# EAGLE design clock2 (EAGLE 5.11)

## Sheet 1 of 3
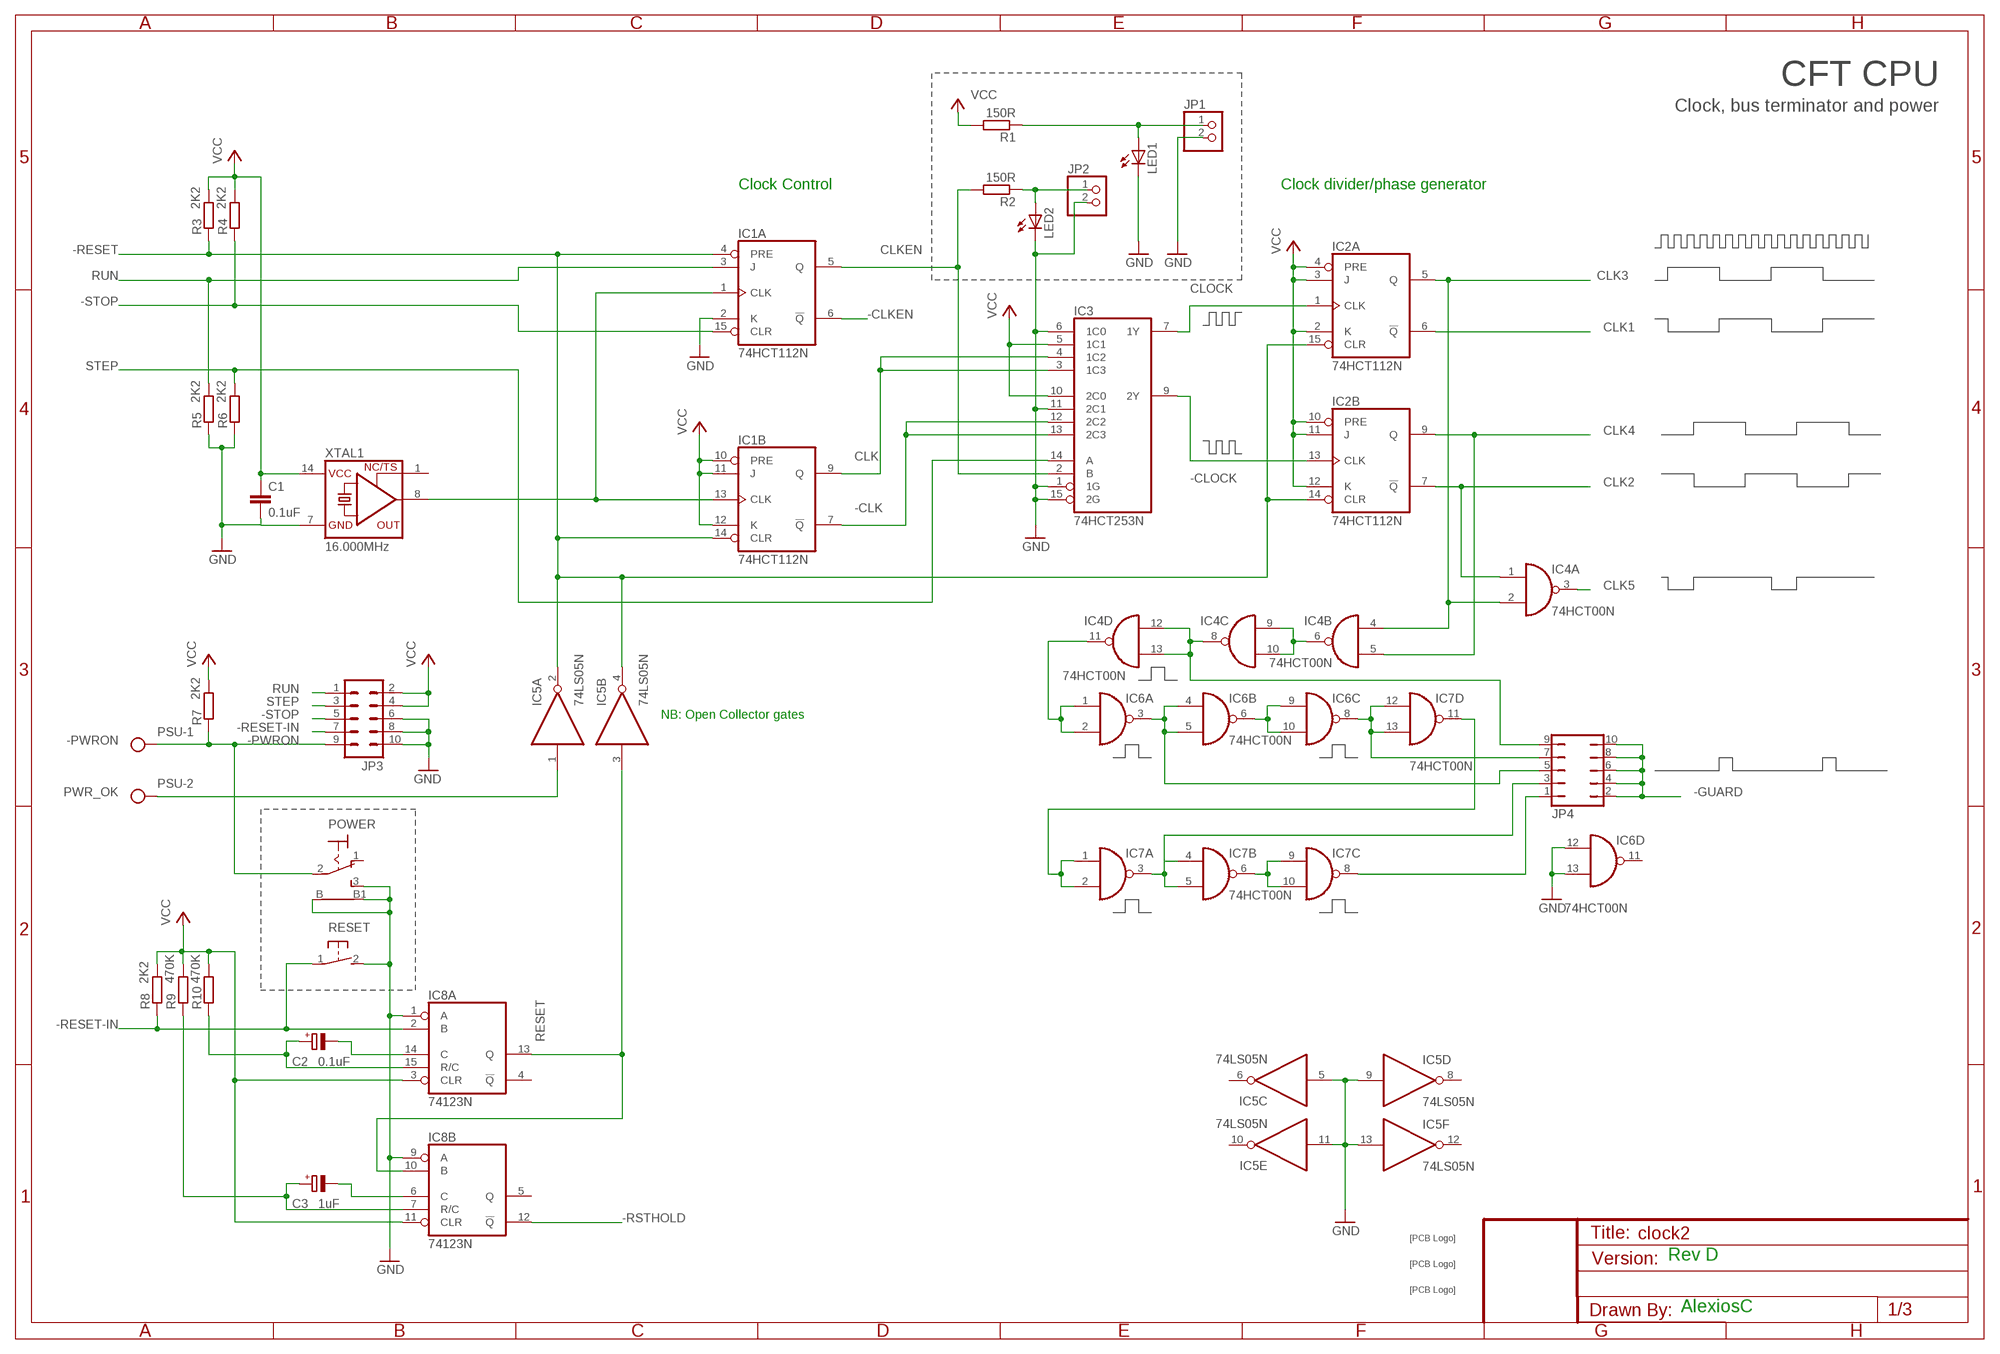
[diagram p0: schematic, sheet 1]

### Parts
C1  0.1uF  C-EU025-025X050  [C025-025X050]
C2  0.1uF  CPOL-EUE2.5-6  [E2,5-6]
C3  1uF  CPOL-EUE2.5-6  [E2,5-6]
IC1  74HCT112N  [DIL16]
IC2  74HCT112N  [DIL16]
IC3  74HCT253N  [DIL16]
IC4  74HCT00N  [DIL14]
IC5  74LS05N  [DIL14]
IC6  74HCT00N  [DIL14]
IC7  74HCT00N  [DIL14]
IC8  74123N  [DIL16]
JP1  PINHD-1X2  [1X02]
JP2  PINHD-1X2  [1X02]
JP3  ML10  [ML10]
JP4  JP5Q  [JP5Q]
LED1  DIALIGHT_555-1XXXF  [LED_PCB2]
LED2  DIALIGHT_555-1XXXF  [LED_PCB2]
POWER  9070-1W  [9070-1W]
PSU  W237-102  [W237-102]
R1  150R  R-EU_0204/7  [0204/7]
R2  150R  R-EU_0204/7  [0204/7]
R3  2K2  R-EU_0204/7  [0204/7]
R4  2K2  R-EU_0204/7  [0204/7]
R5  2K2  R-EU_0204/7  [0204/7]
R6  2K2  R-EU_0204/7  [0204/7]
R7  2K2  R-EU_0204/7  [0204/7]
R8  2K2  R-EU_0204/7  [0204/7]
R9  470K  R-EU_0204/7  [0204/7]
R10  470K  R-EU_0204/7  [0204/7]
RESET  31-XX  [B3F-31XX]
U$1  SIGNATUREPLANE  [SIGNATURE_PLANE]
U$2  SIGNATUREPLANE  [SIGNATURE_PLANE]
U$3  SIGNATURESILK  [SIGNATURE]
XTAL1  16.000MHz  XO-14  [DIL14S]

### Nets
-CLK: IC1.7(B:!Q) IC3.12(2C2) IC3.13(2C3)
-CLKEN: IC1.6(A:!Q)
-CLOCK: IC2.13(B:CLK) IC3.9(2Y)
-GUARD: JP4.2 JP4.4 JP4.6 JP4.8 JP4.10 ; also sheet 2,3
-PWRON: JP3.9 POWER.2(P) PSU.1 R7.1
-RESET: IC1.4(A:PRE) IC1.14(B:CLR) IC2.14(B:CLR) IC2.15(A:CLR) IC5.2(A:O) IC5.4(B:O) R3.1 ; also sheet 2,3
-RESET-IN: IC8.2(A:B) JP3.7 R8.1 RESET.1(P)
-RSTHOLD: IC8.12(B:!Q) ; also sheet 2,3
-STOP: IC1.15(A:CLR) JP3.5 R4.1
CLK: IC1.9(B:Q) IC3.3(1C3) IC3.4(1C2)
CLK1: IC2.6(A:!Q) ; also sheet 3
CLK2: IC2.7(B:!Q) IC4.1(A:I0) ; also sheet 3
CLK3: IC2.5(A:Q) IC4.2(A:I1) IC4.4(B:I0) ; also sheet 3
CLK4: IC2.9(B:Q) IC4.5(B:I1) ; also sheet 3
CLK5: IC4.3(A:O) ; also sheet 3
CLKEN: IC1.5(A:Q) IC3.2(B) R2.2
CLOCK: IC2.1(A:CLK) IC3.7(1Y)
GND: C1.2 IC1.2(A:K) IC3.1(1G) IC3.6(1C0) IC3.11(2C1) IC3.15(2G) IC5.5(C:I) IC5.9(D:I) IC5.11(E:I) IC5.13(F:I) IC6.12(D:I0) IC6.13(D:I1) IC8.1(A:A) IC8.9(B:A) JP1.2 JP2.2 JP3.6 JP3.8 JP3.10 LED1.K(C) LED2.K(C) POWER.3(S) POWER.B POWER.B1 R5.1 R6.1 RESET.2(S) XTAL1.7(GND) ; also sheet 2,3
N$2: IC7.8(C:O) JP4.1
N$5: IC1.1(A:CLK) IC1.13(B:CLK) XTAL1.8(OUT)
N$6: C2.+ IC8.15(A:R/C) R10.2
N$8: C2.- IC8.14(A:C)
N$9: C3.+ IC8.7(B:R/C) R9.2
N$10: C3.- IC8.6(B:C)
N$11: IC6.3(A:O) IC6.4(B:I0) IC6.5(B:I1) JP4.5
N$12: IC6.6(B:O) IC6.9(C:I0) IC6.10(C:I1)
N$13: IC6.8(C:O) IC7.12(D:I0) IC7.13(D:I1) JP4.7
N$14: IC7.1(A:I0) IC7.2(A:I1) IC7.11(D:O)
N$15: IC7.3(A:O) IC7.4(B:I0) IC7.5(B:I1) JP4.3
N$16: IC7.6(B:O) IC7.9(C:I0) IC7.10(C:I1)
N$18: IC4.6(B:O) IC4.9(C:I0) IC4.10(C:I1)
N$19: IC4.8(C:O) IC4.12(D:I0) IC4.13(D:I1) JP4.9
N$20: IC4.11(D:O) IC6.1(A:I0) IC6.2(A:I1)
N$49: JP2.1 LED2.A R2.1
POWERLED: JP1.1 LED1.A R1.1
PWR_OK: IC5.1(A:I) PSU.2
RESET: IC5.3(B:I) IC8.10(B:B) IC8.13(A:Q)
RUN: IC1.3(A:J) JP3.1 R5.2
STEP: IC3.14(A) JP3.3 R6.2
VCC: C1.1 IC1.10(B:PRE) IC1.11(B:J) IC1.12(B:K) IC2.2(A:K) IC2.3(A:J) IC2.4(A:PRE) IC2.10(B:PRE) IC2.11(B:J) IC2.12(B:K) IC3.5(1C1) IC3.10(2C0) IC8.3(A:CLR) IC8.11(B:CLR) JP3.2 JP3.4 R1.2 R3.2 R4.2 R7.2 R8.2 R9.1 R10.1 XTAL1.14(VCC) ; also sheet 2,3
Unconnected: IC5.6(C:O) IC5.8(D:O) IC5.10(E:O) IC5.12(F:O) IC6.11(D:O) IC8.4(A:!Q) IC8.5(B:Q) POWER.1(O) XTAL1.1(TS)

### Notes on the sheet
- CFT CPU
- Clock, bus terminator and power
- Clock Control | Clock divider/phase generator
- NB: Open Collector gates
- Rev D
- AlexiosC

## Sheet 2 of 3
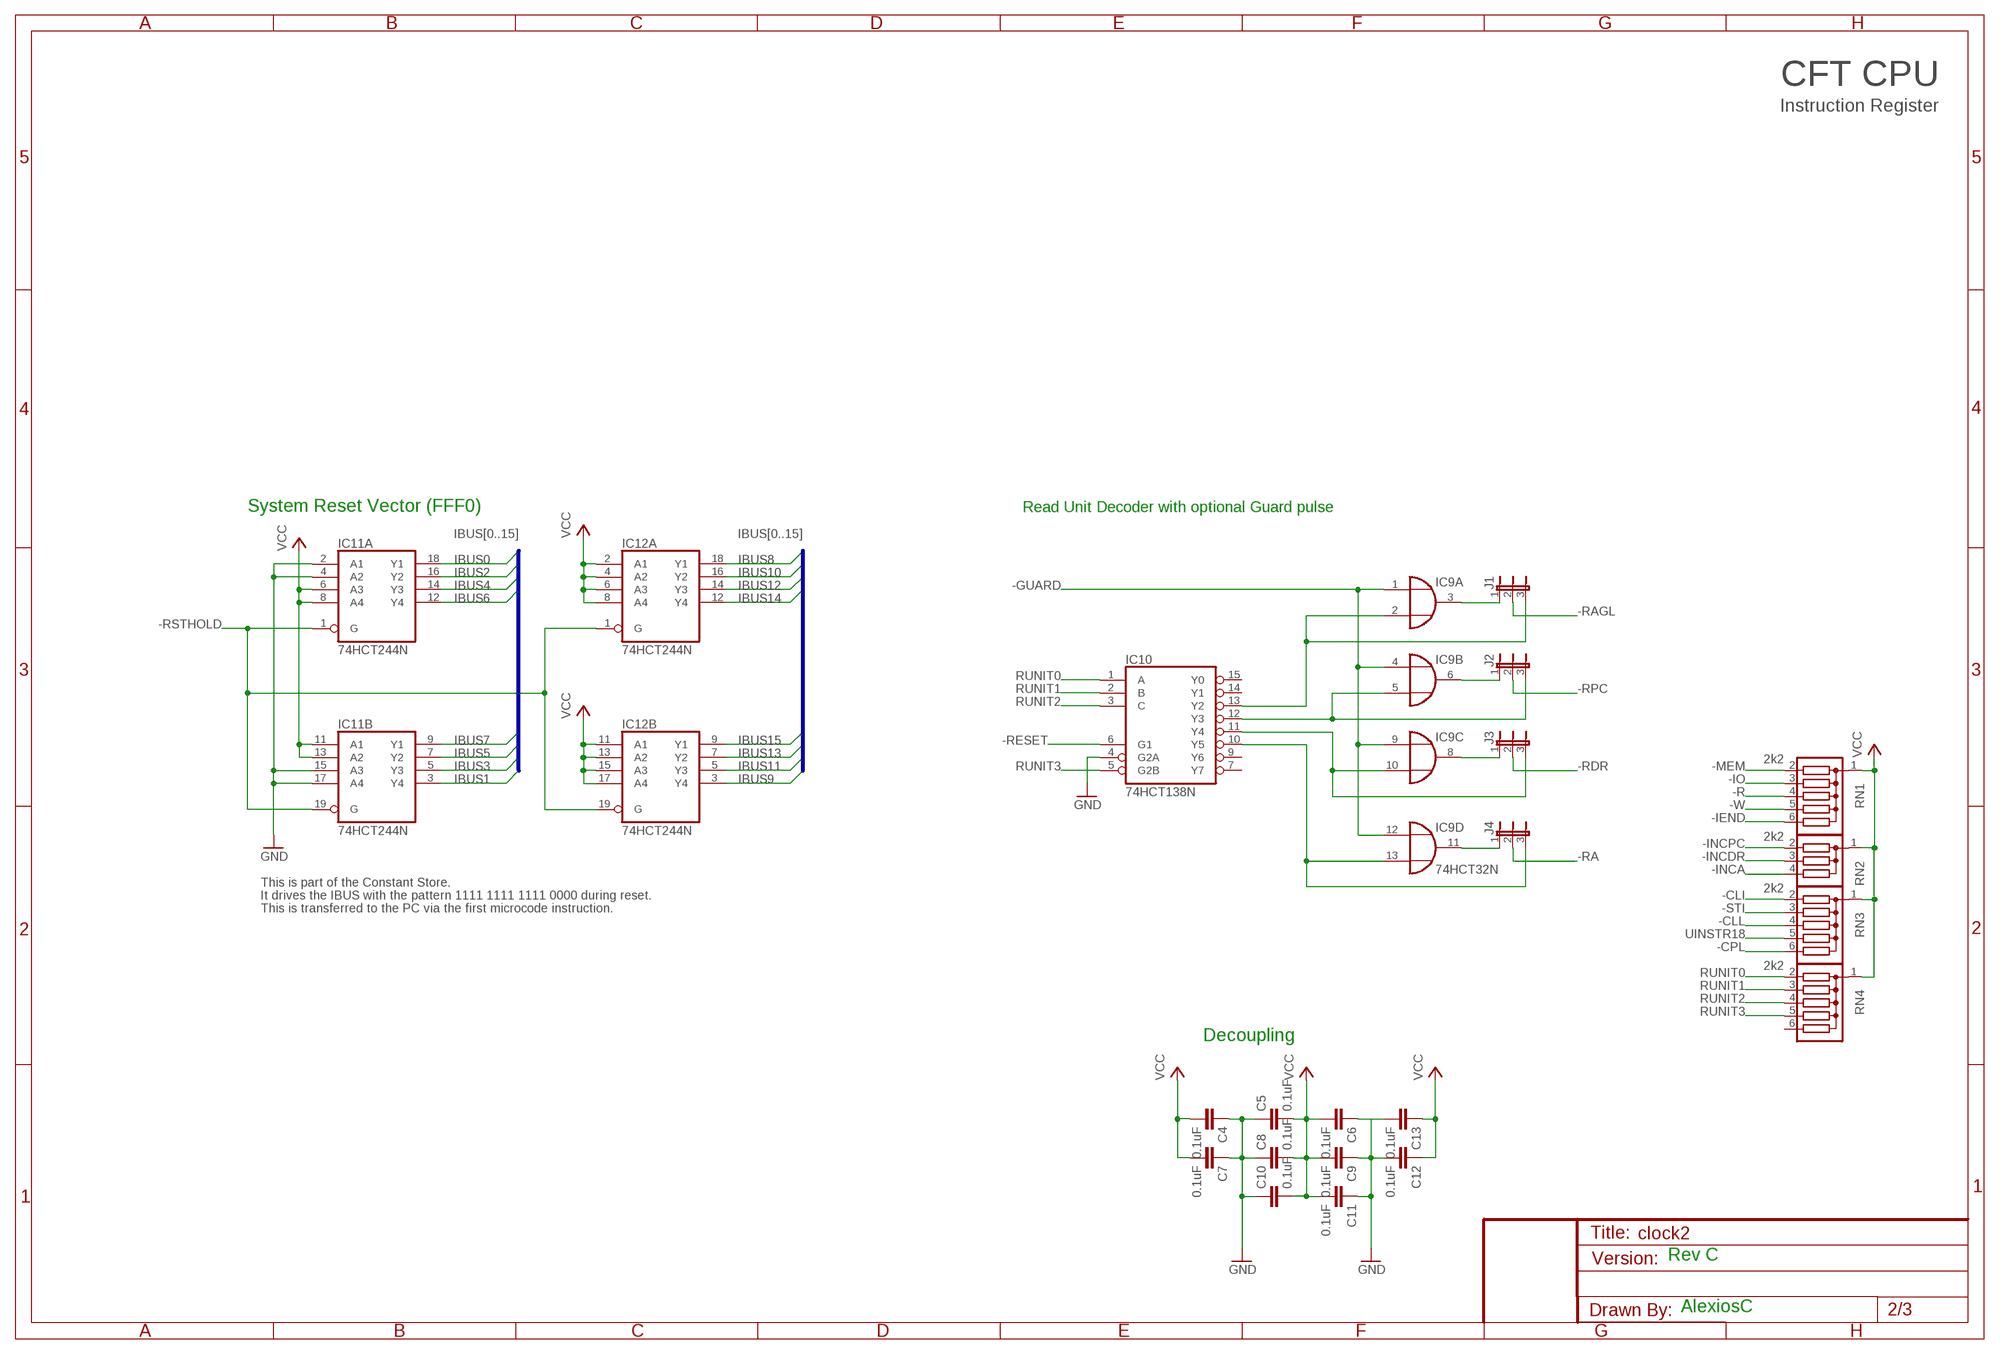
[diagram p1: schematic, sheet 2]

### Parts
C4  0.1uF  C-EU025-025X050  [C025-025X050]
C5  0.1uF  C-EU025-025X050  [C025-025X050]
C6  0.1uF  C-EU025-025X050  [C025-025X050]
C7  0.1uF  C-EU025-025X050  [C025-025X050]
C8  0.1uF  C-EU025-025X050  [C025-025X050]
C9  0.1uF  C-EU025-025X050  [C025-025X050]
C10  0.1uF  C-EU025-025X050  [C025-025X050]
C11  0.1uF  C-EU025-025X050  [C025-025X050]
C12  0.1uF  C-EU025-025X050  [C025-025X050]
C13  0.1uF  C-EU025-025X050  [C025-025X050]
IC9  74HCT32N  [DIL14]
IC10  74HCT138N  [DIL16]
IC11  74HCT244N  [DIL20]
IC12  74HCT244N  [DIL20]
J1  JP2E  [JP2]
J2  JP2E  [JP2]
J3  JP2E  [JP2]
J4  JP2E  [JP2]
RN1  2k2  G05R  [SIL6]
RN2  2k2  G03R  [SIL4]
RN3  2k2  G05R  [SIL6]
RN4  2k2  G05R  [SIL6]

### Nets
-CLI: RN3.2 ; also sheet 3
-CLL: RN3.4 ; also sheet 3
-CPL: RN3.6 ; also sheet 3
-GUARD: IC9.1(A:I0) IC9.4(B:I0) IC9.9(C:I0) IC9.12(D:I0) ; also sheet 1,3
-IEND: RN1.6
-INCA: RN2.4 ; also sheet 3
-INCDR: RN2.3 ; also sheet 3
-INCPC: RN2.2 ; also sheet 3
-IO: RN1.3 ; also sheet 3
-MEM: RN1.2 ; also sheet 3
-R: RN1.4 ; also sheet 3
-RA: J4.2 ; also sheet 3
-RAGL: J1.2 ; also sheet 3
-RDR: J3.2 ; also sheet 3
-RESET: IC10.6(G1) ; also sheet 1,3
-RPC: J2.2 ; also sheet 3
-RSTHOLD: IC11.1(A:G) IC11.19(B:G) IC12.1(A:G) IC12.19(B:G) ; also sheet 1,3
-STI: RN3.3 ; also sheet 3
-W: RN1.5 ; also sheet 3
GND: C4.1 C5.1 C6.1 C7.1 C8.1 C9.1 C10.1 C11.1 C12.2 C13.2 IC10.4(G2A) IC11.2(A:A1) IC11.4(A:A2) IC11.15(B:A3) IC11.17(B:A4) ; also sheet 1,3
IBUS0: IC11.18(A:Y1) ; also sheet 3
IBUS1: IC11.3(B:Y4) ; also sheet 3
IBUS2: IC11.16(A:Y2) ; also sheet 3
IBUS3: IC11.5(B:Y3) ; also sheet 3
IBUS4: IC11.14(A:Y3) ; also sheet 3
IBUS5: IC11.7(B:Y2) ; also sheet 3
IBUS6: IC11.12(A:Y4) ; also sheet 3
IBUS7: IC11.9(B:Y1) ; also sheet 3
IBUS8: IC12.18(A:Y1) ; also sheet 3
IBUS9: IC12.3(B:Y4) ; also sheet 3
IBUS10: IC12.16(A:Y2) ; also sheet 3
IBUS11: IC12.5(B:Y3) ; also sheet 3
IBUS12: IC12.14(A:Y3) ; also sheet 3
IBUS13: IC12.7(B:Y2) ; also sheet 3
IBUS14: IC12.12(A:Y4) ; also sheet 3
IBUS15: IC12.9(B:Y1) ; also sheet 3
N$17: IC9.2(A:I1) IC10.13(Y2) J1.3
N$21: IC9.5(B:I1) IC10.12(Y3) J2.3
N$22: IC9.10(C:I1) IC10.11(Y4) J3.3
N$23: IC9.13(D:I1) IC10.10(Y5) J4.3
N$24: IC9.3(A:O) J1.1
N$25: IC9.6(B:O) J2.1
N$26: IC9.11(D:O) J4.1
N$27: IC9.8(C:O) J3.1
RUNIT0: IC10.1(A) RN4.2 ; also sheet 3
RUNIT1: IC10.2(B) RN4.3 ; also sheet 3
RUNIT2: IC10.3(C) RN4.4 ; also sheet 3
RUNIT3: IC10.5(G2B) RN4.5 ; also sheet 3
UINSTR18: RN3.5 ; also sheet 3
VCC: C4.2 C5.2 C6.2 C7.2 C8.2 C9.2 C10.2 C11.2 C12.1 C13.1 IC11.6(A:A3) IC11.8(A:A4) IC11.11(B:A1) IC11.13(B:A2) IC12.2(A:A1) IC12.4(A:A2) IC12.6(A:A3) IC12.8(A:A4) IC12.11(B:A1) IC12.13(B:A2) IC12.15(B:A3) IC12.17(B:A4) RN1.1 RN2.1 RN3.1 RN4.1 ; also sheet 1,3
Unconnected: IC10.7(Y7) IC10.9(Y6) IC10.14(Y1) IC10.15(Y0) RN4.6

### Buses
IBUS[0..15]

### Notes on the sheet
- CFT CPU
- Instruction Register
- System Reset Vector (FFF0) | Read Unit Decoder with optional Guard pulse
- This is part of the Constant Store.
- It drives the IBUS with the pattern 1111 1111 1111 0000 during reset.
- This is transferred to the PC via the first microcode instruction.
- Decoupling
- Rev C
- AlexiosC

## Sheet 3 of 3
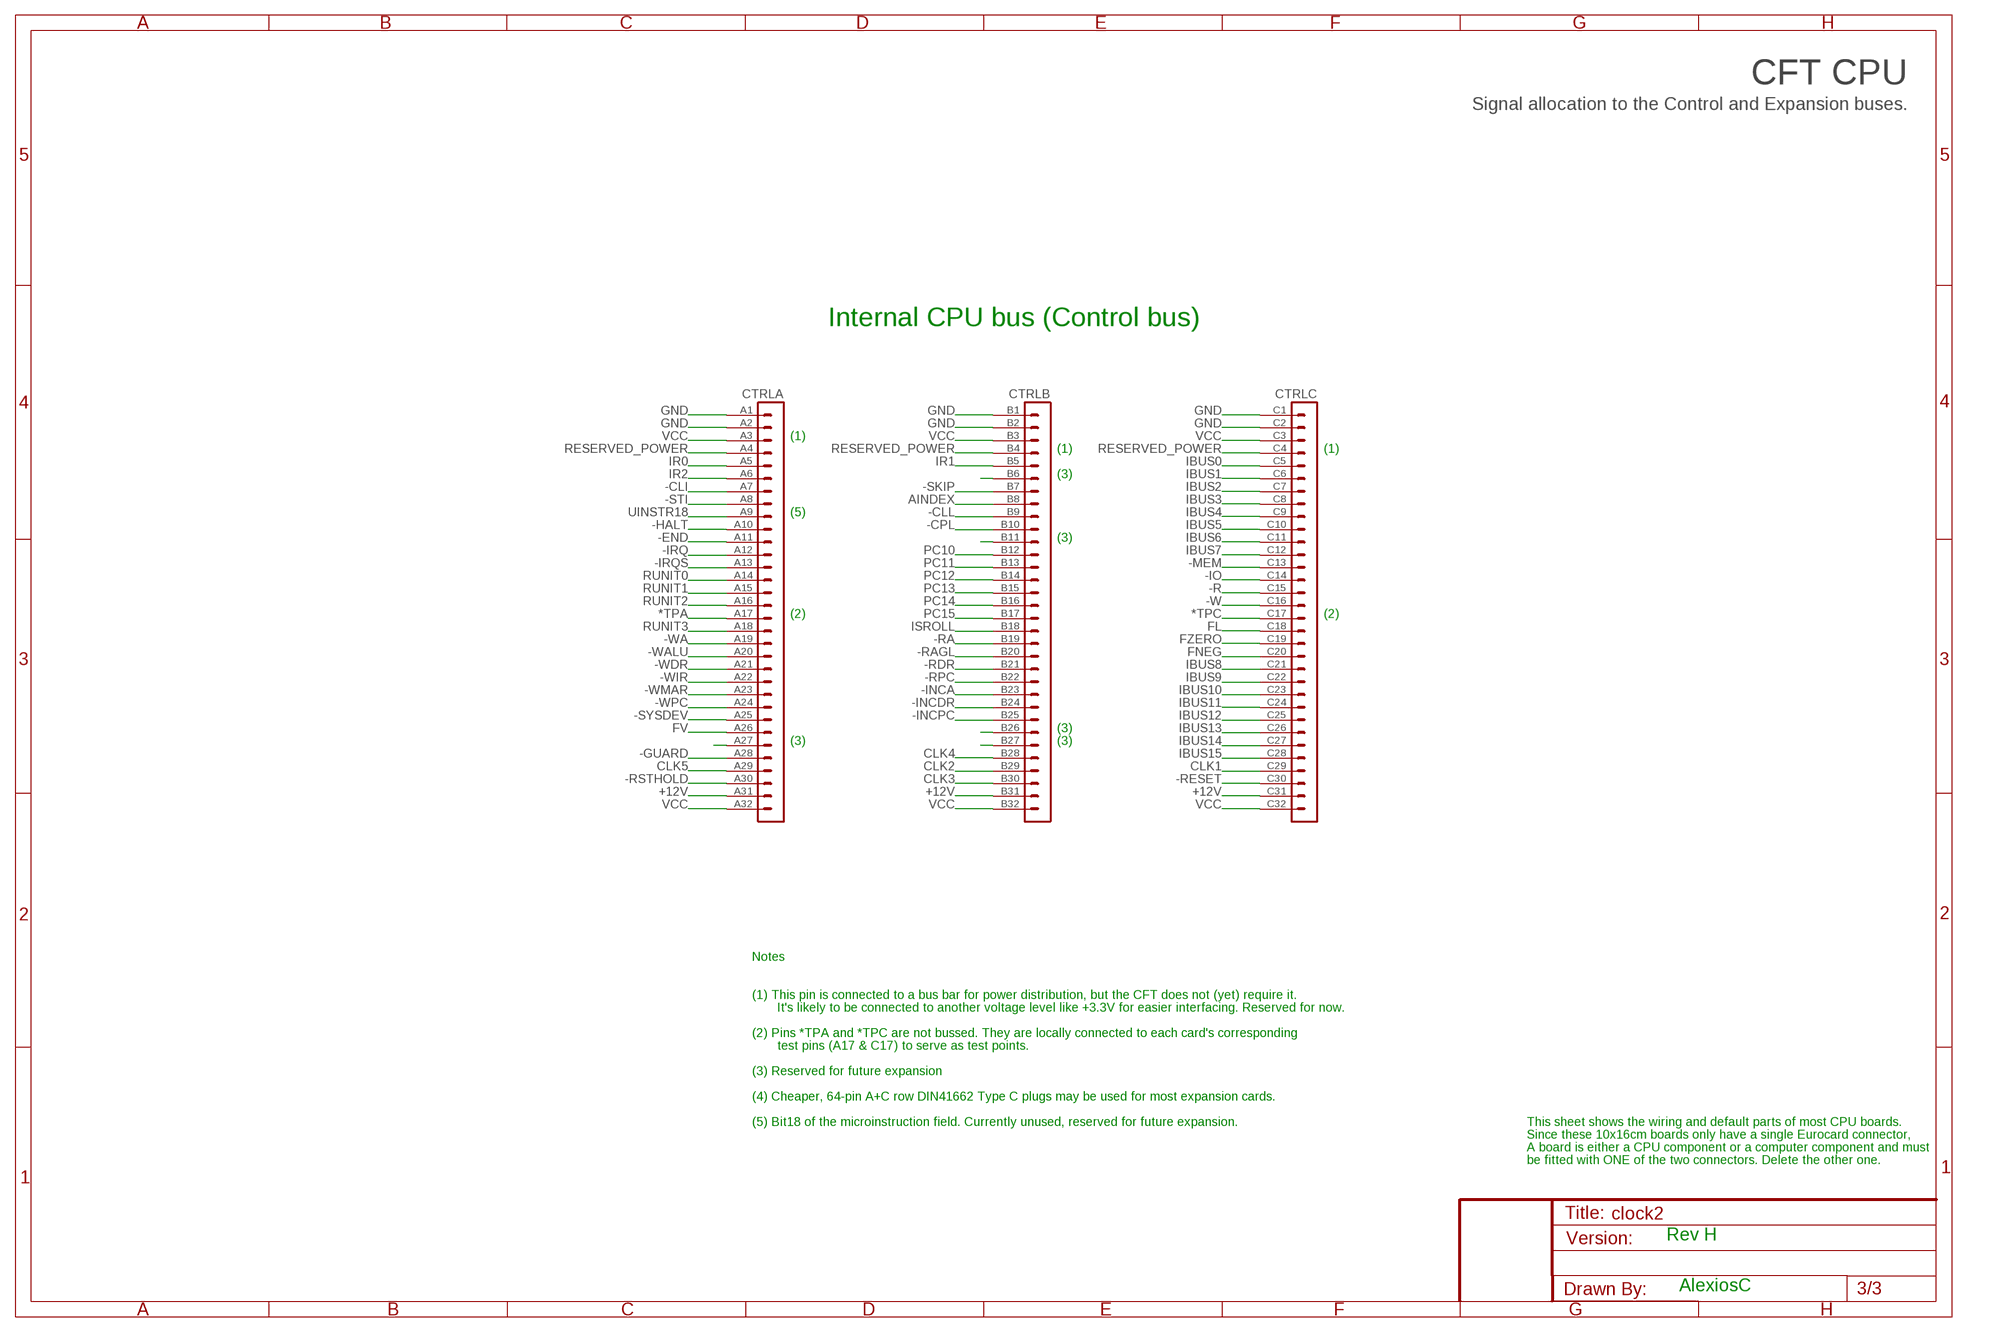
[diagram p2: schematic, sheet 3]

### Parts
CTRL  VG96-3B  [VG96B]

### Nets
*TPA: CTRL.A17
*TPC: CTRL.C17
+12V [12V]: CTRL.A31 CTRL.B31 CTRL.C31
-CLI: CTRL.A7 ; also sheet 2
-CLL: CTRL.B9 ; also sheet 2
-CPL: CTRL.B10 ; also sheet 2
-END: CTRL.A11
-GUARD: CTRL.A28 ; also sheet 1,2
-HALT: CTRL.A10
-INCA: CTRL.B23 ; also sheet 2
-INCDR: CTRL.B24 ; also sheet 2
-INCPC: CTRL.B25 ; also sheet 2
-IO: CTRL.C14 ; also sheet 2
-IRQ: CTRL.A12
-IRQS: CTRL.A13
-MEM: CTRL.C13 ; also sheet 2
-R: CTRL.C15 ; also sheet 2
-RA: CTRL.B19 ; also sheet 2
-RAGL: CTRL.B20 ; also sheet 2
-RDR: CTRL.B21 ; also sheet 2
-RESET: CTRL.C30 ; also sheet 1,2
-RPC: CTRL.B22 ; also sheet 2
-RSTHOLD: CTRL.A30 ; also sheet 1,2
-SKIP: CTRL.B7
-STI: CTRL.A8 ; also sheet 2
-SYSDEV: CTRL.A25
-W: CTRL.C16 ; also sheet 2
-WA: CTRL.A19
-WALU: CTRL.A20
-WDR: CTRL.A21
-WIR: CTRL.A22
-WMAR: CTRL.A23
-WPC: CTRL.A24
AINDEX: CTRL.B8
CLK1: CTRL.C29 ; also sheet 1
CLK2: CTRL.B29 ; also sheet 1
CLK3: CTRL.B30 ; also sheet 1
CLK4: CTRL.B28 ; also sheet 1
CLK5: CTRL.A29 ; also sheet 1
FL: CTRL.C18
FNEG: CTRL.C20
FV: CTRL.A26
FZERO: CTRL.C19
GND: CTRL.A1 CTRL.A2 CTRL.B1 CTRL.B2 CTRL.C1 CTRL.C2 ; also sheet 1,2
IBUS0: CTRL.C5 ; also sheet 2
IBUS1: CTRL.C6 ; also sheet 2
IBUS2: CTRL.C7 ; also sheet 2
IBUS3: CTRL.C8 ; also sheet 2
IBUS4: CTRL.C9 ; also sheet 2
IBUS5: CTRL.C10 ; also sheet 2
IBUS6: CTRL.C11 ; also sheet 2
IBUS7: CTRL.C12 ; also sheet 2
IBUS8: CTRL.C21 ; also sheet 2
IBUS9: CTRL.C22 ; also sheet 2
IBUS10: CTRL.C23 ; also sheet 2
IBUS11: CTRL.C24 ; also sheet 2
IBUS12: CTRL.C25 ; also sheet 2
IBUS13: CTRL.C26 ; also sheet 2
IBUS14: CTRL.C27 ; also sheet 2
IBUS15: CTRL.C28 ; also sheet 2
IR0: CTRL.A5
IR1: CTRL.B5
IR2: CTRL.A6
ISROLL: CTRL.B18
N$1: CTRL.B27
N$3: CTRL.B6
N$4: CTRL.A27
N$7: CTRL.B26
N$47: CTRL.B11
PC10: CTRL.B12
PC11: CTRL.B13
PC12: CTRL.B14
PC13: CTRL.B15
PC14: CTRL.B16
PC15: CTRL.B17
RESERVED_POWER: CTRL.A4 CTRL.B4 CTRL.C4
RUNIT0: CTRL.A14 ; also sheet 2
RUNIT1: CTRL.A15 ; also sheet 2
RUNIT2: CTRL.A16 ; also sheet 2
RUNIT3: CTRL.A18 ; also sheet 2
UINSTR18: CTRL.A9 ; also sheet 2
VCC: CTRL.A3 CTRL.A32 CTRL.B3 CTRL.B32 CTRL.C3 CTRL.C32 ; also sheet 1,2

### Notes on the sheet
- CFT CPU
- Signal allocation to the Control and Expansion buses.
- Internal CPU bus (Control bus)
- (1)
- (1) | (1)
- (3)
- (5)
- (3)
- (2) | (2)
- (3)
- (3) | (3)
- Notes
- (1) This pin is connected to a bus bar for power distribution, but the CFT does not (yet) require it.
- It's likely to be connected to another voltage level like +3.3V for easier interfacing. Reserved for now.
- (2) Pins *TPA and *TPC are not bussed. They are locally connected to each card's corresponding
- test pins (A17 & C17) to serve as test points.
- (3) Reserved for future expansion
- (4) Cheaper, 64-pin A+C row DIN41662 Type C plugs may be used for most expansion cards.
- (5) Bit18 of the microinstruction field. Currently unused, reserved for future expansion. | This sheet shows the wiring and default parts of most CPU boards.
- Since these 10x16cm boards only have a single Eurocard connector,
- A board is either a CPU component or a computer component and must
- be fitted with ONE of the two connectors. Delete the other one.
- Rev H
- AlexiosC

## Power pins joined to a net without a drawn wire
GND: IC1.8(P:GND) IC2.8(P:GND) IC3.8(GND) IC4.7(P:GND) IC5.7(P:GND) IC6.7(P:GND) IC7.7(P:GND) IC8.8(P:GND) IC9.7(P:GND) IC10.8(GND) IC11.10(P:GND) IC12.10(P:GND)
VCC: IC1.16(P:VCC) IC2.16(P:VCC) IC3.16(VCC) IC4.14(P:VCC) IC5.14(P:VCC) IC6.14(P:VCC) IC7.14(P:VCC) IC8.16(P:VCC) IC9.14(P:VCC) IC10.16(VCC) IC11.20(P:VCC) IC12.20(P:VCC)

## Library data of the parts
C1 C4-C13 = rcl:C-EU: CAPACITOR, European symbol
C2 C3 = rcl:CPOL-EU: POLARIZED CAPACITOR, European symbol
CTRL = 19inch:VG96-3: PCB EUROCARD, 96-pin type C/ABC, 2.54 mm
IC1 IC2 = 74xx-eu:74*112: Dual J-K negative edge triggered FLIP FLOP, preset and clear
IC3 = 74xx-eu:74*253: Dual 4-to 1 line data SELECTOR/MULTIPLEXER, 3-state
IC4 IC6 IC7 = 74xx-eu:74*00: Quad 2-input NAND gate
IC5 = 74xx-us:74*05: Hex INVERTER, open collector
IC8 = 74xx-eu:74*123: Retriggerable monostable MULTIVIBRATOR
IC9 = 74xx-eu:74*32: Quad 2-input OR gate
IC10 = 74xx-eu:74*138: 3-line to 8-line DECODER/DEMULTIPLEXER
IC11 IC12 = 74xx-eu:74*244: Octal BUFFER and LINE DRIVER, 3-state
J1-J4 = jumper:JP2E: JUMPER
JP1 JP2 = pinhead:PINHD-1X2: PIN HEADER
JP3 = con-ml:ML10: HARTING; OC_FARNELL: unknown; OC_NEWARK: unknown
JP4 = jumper:JP5Q: JUMPER
LED1 LED2 = alexios:DIALIGHT_555-1XXXF: 3mm PCB LED. Farnell: description <http://uk.farnell.com/dialight/551-1307f/led-pcb-3mm-lc-green/dp/1306035>
POWER = switch:9070-1W: TOGGLE SWITCH Marquardt
PSU = con-wago-500:W237-102: WAGO SCREW CLAMP; MPN: 237-102; OC_FARNELL: unknown; OC_NEWARK: 70K9898
R1-R10 = resistor:R-EU_: RESISTOR, European symbol
RESET = switch-omron:31-XX: OMRON SWITCH; MPN: B3F-3100; OC_FARNELL: 959704; OC_NEWARK: 36M3582
RN1 RN3 RN4 = resistor-sil:G05R: SIL RESISTOR; OC_FARNELL: unknown; OC_NEWARK: unknown
RN2 = resistor-sil:G03R: SIL RESISTOR; OC_FARNELL: unknown; OC_NEWARK: unknown
U$1-U$3 = alexios:SIGNATURE: Soup signature
XTAL1 = crystal:XO-14: CRYSTAL RESONATOR

## Net classes
0 default: width 0.305 mm, clearance 0.305 mm
1 Power: width 0.635 mm, clearance 0.635 mm
2 12V: width 0.635 mm, clearance 0.635 mm

## Board
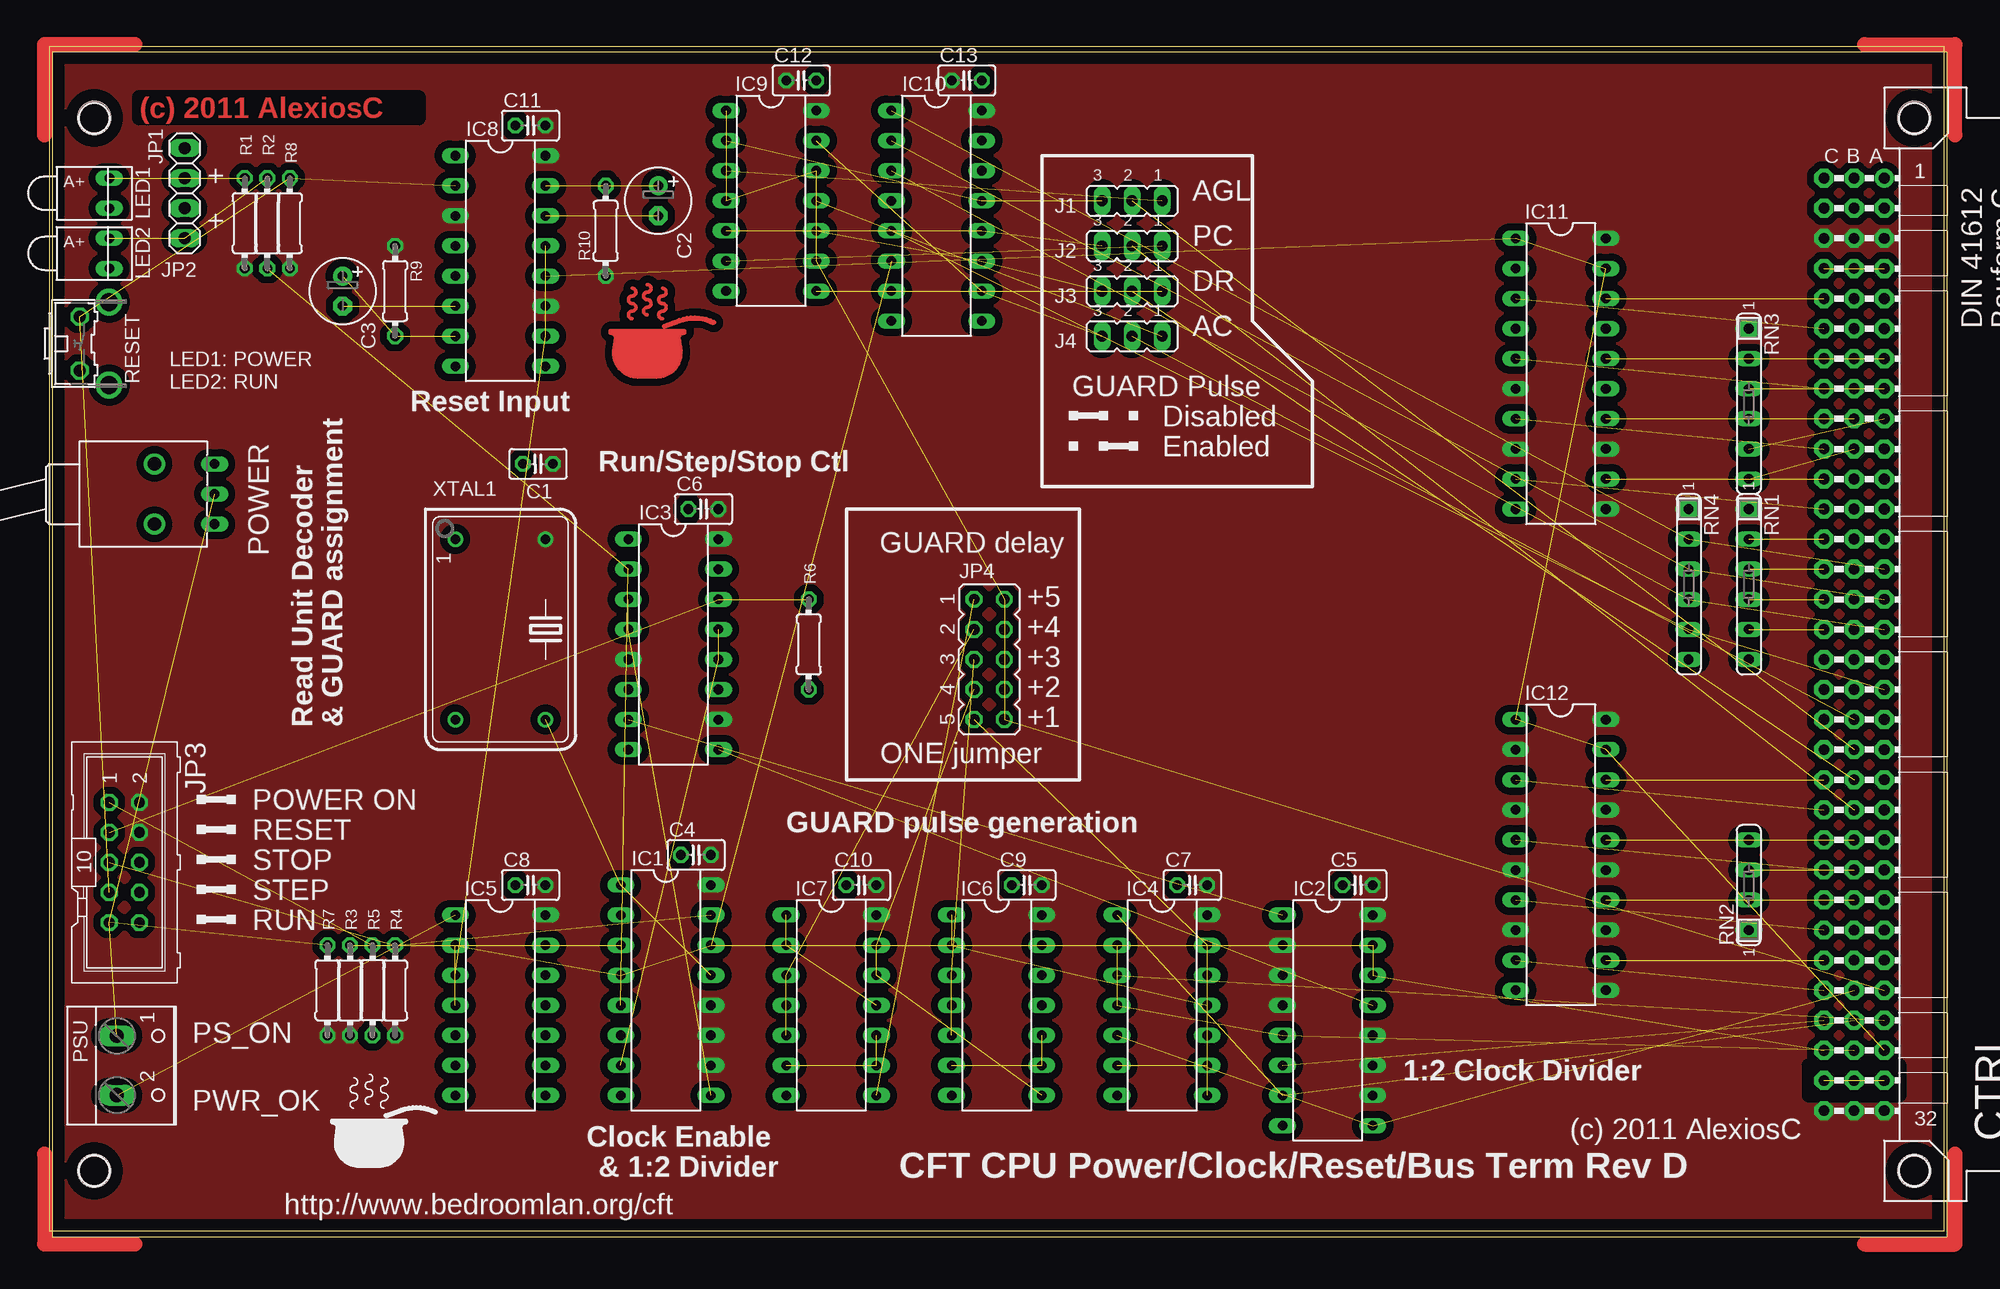
[diagram p3: board, top side]
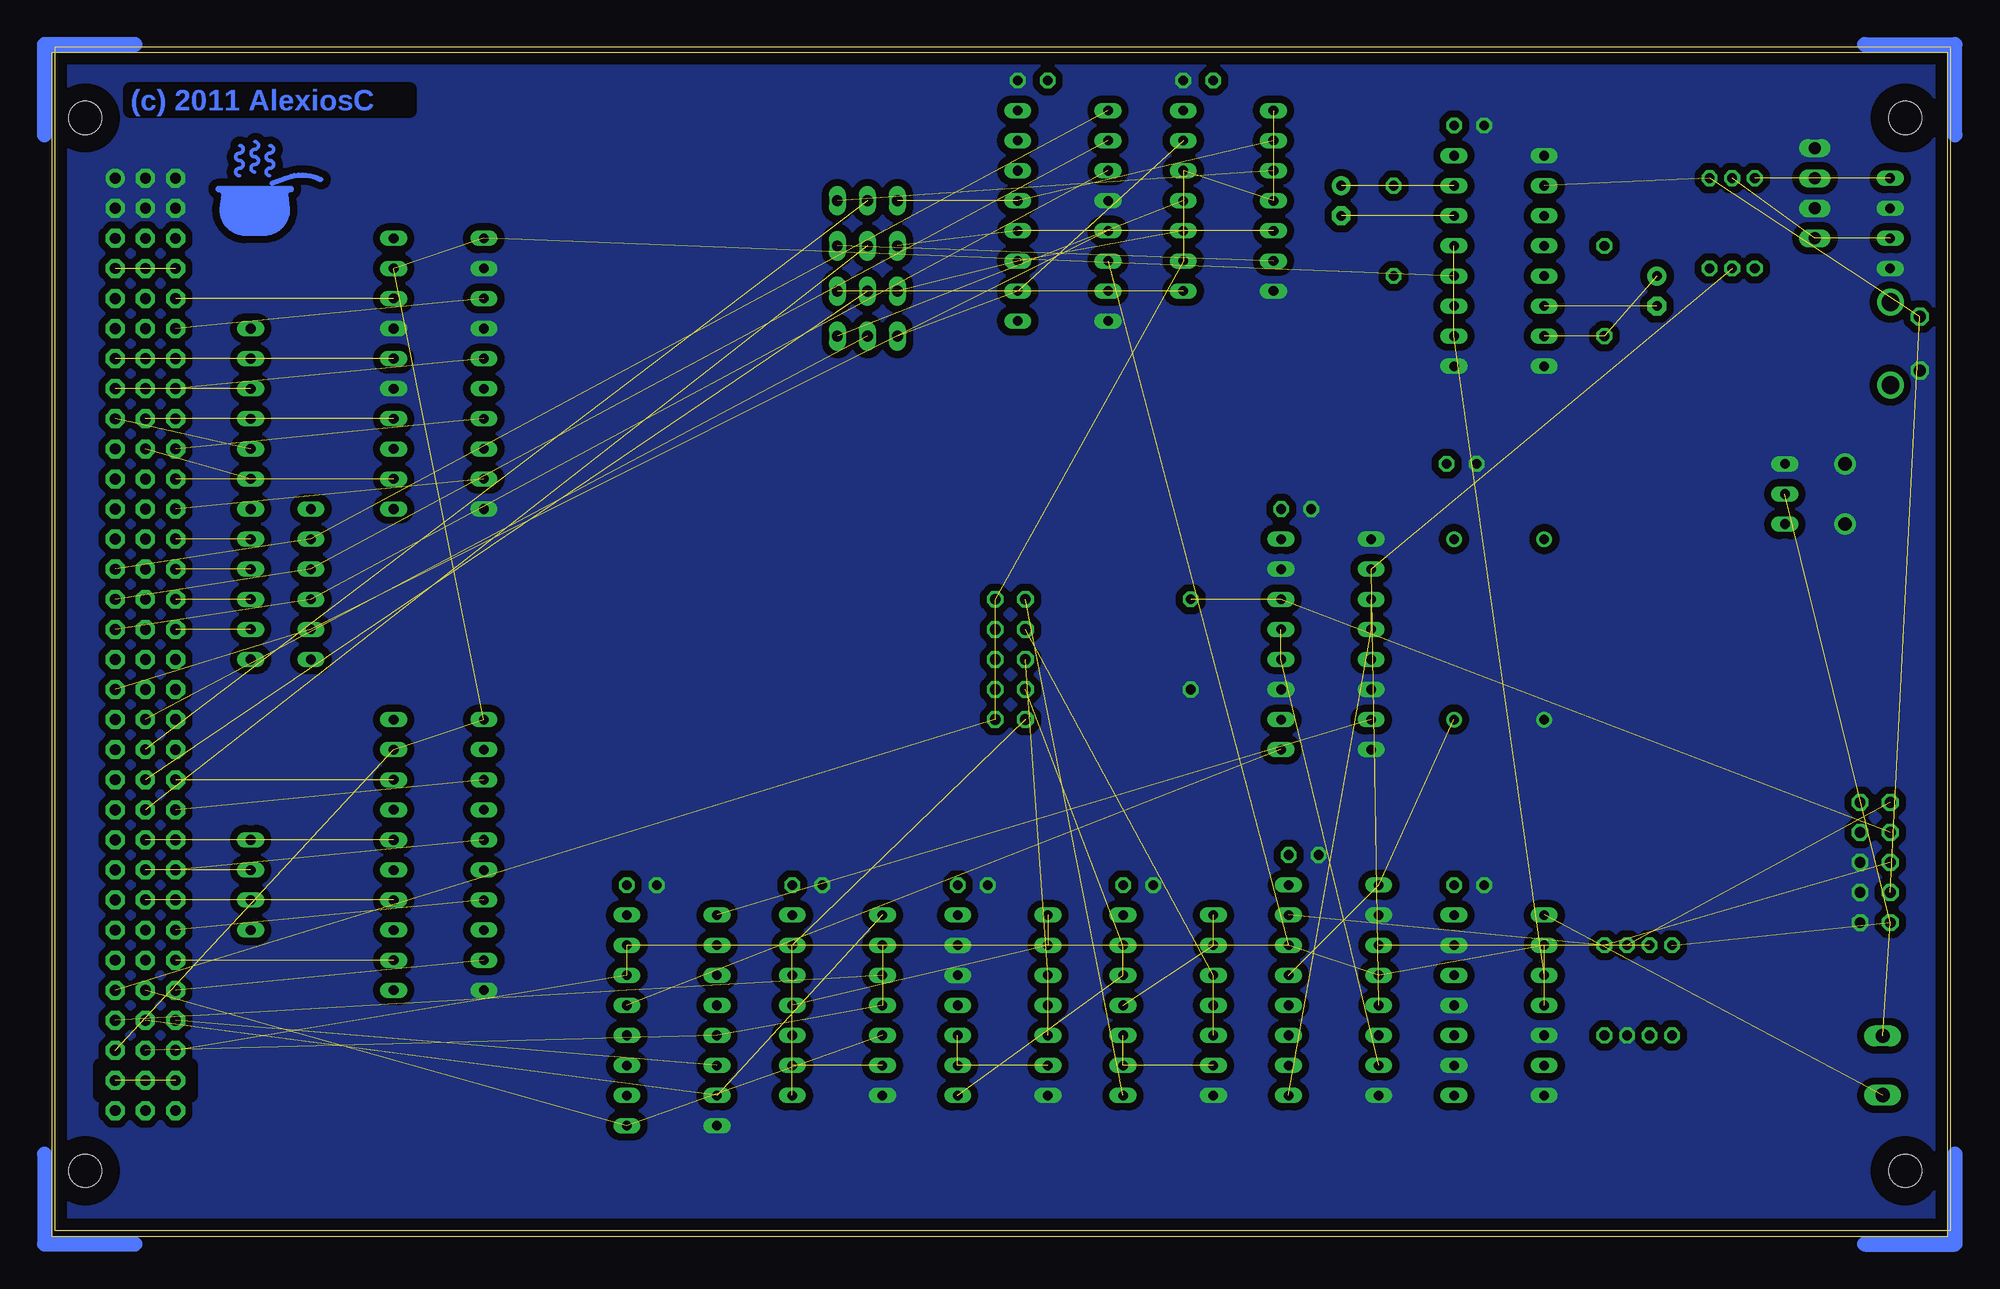
[diagram p4: board, bottom side, seen from below]

Size 160 x 100 mm. Coordinates in mm from the lower left corner, seen from the top.
Outline: 0,0 160,0 160,100 0,100 0,0
Copper layers (1*16): Top 0.035mm / dielectric 1.5mm / Bottom 0.035mm
Design rules "cft-olimex-10mil": minimum track width 10mil, minimum drill 24mil, track to track 10mil, track to pad 10mil, pad to pad 10mil, via to via 10mil, smd to smd 10mil, copper to edge 40mil, drill to drill 10mil, minimum pad ring 10mil, minimum via ring 10mil, stop-mask expansion 0mil, vias tented up to drill 10mil, thermal gap 10mil
tRestrict: area 148.6,11.4 to 156.2,14
bRestrict: area 148.6,11.4 to 156.2,14

### Footprints (pad centres in the part's own frame; a part is rotated, then mirrored left to right if it is on the bottom)
C025-025X050 = drill 0.813 octagon: 1 -1.27,0; 2 1.27,0
E2,5-6 = drill 0.813 pad 1.6 round: + -1.27,0 | drill 0.813 pad 1.6 octagon: - 1.27,0
VG96B = drill 0.914 pad 1.6 round: A1 154.94,39.37 | drill 0.914 pad 1.6 octagon: A2 154.94,36.83; A3 154.94,34.29; A4 154.94,31.75; A5 154.94,29.21; A6 154.94,26.67; A7 154.94,24.13; A8 154.94,21.59; A9 154.94,19.05; A10 154.94,16.51; A11 154.94,13.97; A12 154.94,11.43; A13 154.94,8.89; A14 154.94,6.35; A15 154.94,3.81; A16 154.94,1.27; A17 154.94,-1.27; A18 154.94,-3.81; A19 154.94,-6.35; A20 154.94,-8.89; A21 154.94,-11.43; A22 154.94,-13.97; A23 154.94,-16.51; A24 154.94,-19.05; A25 154.94,-21.59; A26 154.94,-24.13; A27 154.94,-26.67; A28 154.94,-29.21; A29 154.94,-31.75; A30 154.94,-34.29; A31 154.94,-36.83; A32 154.94,-39.37; B1 152.4,39.37; B2 152.4,36.83; B3 152.4,34.29; B4 152.4,31.75; B5 152.4,29.21; B6 152.4,26.67; B7 152.4,24.13; B8 152.4,21.59; B9 152.4,19.05; B10 152.4,16.51; B11 152.4,13.97; B12 152.4,11.43; B13 152.4,8.89; B14 152.4,6.35; B15 152.4,3.81; B16 152.4,1.27; B17 152.4,-1.27; B18 152.4,-3.81; B19 152.4,-6.35; B20 152.4,-8.89; B21 152.4,-11.43; B22 152.4,-13.97; B23 152.4,-16.51; B24 152.4,-19.05; B25 152.4,-21.59; B26 152.4,-24.13; B27 152.4,-26.67; B28 152.4,-29.21; B29 152.4,-31.75; B30 152.4,-34.29; B31 152.4,-36.83; B32 152.4,-39.37; C1 149.86,39.37; C2 149.86,36.83; C3 149.86,34.29; C4 149.86,31.75; C5 149.86,29.21; C6 149.86,26.67; C7 149.86,24.13; C8 149.86,21.59; C9 149.86,19.05; C10 149.86,16.51; C11 149.86,13.97; C12 149.86,11.43; C13 149.86,8.89; C14 149.86,6.35; C15 149.86,3.81; C16 149.86,1.27; C17 149.86,-1.27; C18 149.86,-3.81; C19 149.86,-6.35; C20 149.86,-8.89; C21 149.86,-11.43; C22 149.86,-13.97; C23 149.86,-16.51; C24 149.86,-19.05; C25 149.86,-21.59; C26 149.86,-24.13; C27 149.86,-26.67; C28 149.86,-29.21; C29 149.86,-31.75; C30 149.86,-34.29; C31 149.86,-36.83; C32 149.86,-39.37 | hole 2.794: 157.48,44.45; 157.48,-44.45; 3.81,44.45; 3.81,-44.45
DIL16 = drill 0.813 long: 1 -8.89,-3.81; 2 -6.35,-3.81; 3 -3.81,-3.81; 4 -1.27,-3.81; 5 1.27,-3.81; 6 3.81,-3.81; 7 6.35,-3.81; 8 8.89,-3.81; 9 8.89,3.81; 10 6.35,3.81; 11 3.81,3.81; 12 1.27,3.81; 13 -1.27,3.81; 14 -3.81,3.81; 15 -6.35,3.81; 16 -8.89,3.81
DIL14 = drill 0.813 long: 1 -7.62,-3.81; 2 -5.08,-3.81; 3 -2.54,-3.81; 4 0,-3.81; 5 2.54,-3.81; 6 5.08,-3.81; 7 7.62,-3.81; 8 7.62,3.81; 9 5.08,3.81; 10 2.54,3.81; 11 0,3.81; 12 -2.54,3.81; 13 -5.08,3.81; 14 -7.62,3.81
DIL20 = drill 0.813 long: 1 -11.43,-3.81; 2 -8.89,-3.81; 3 -6.35,-3.81; 4 -3.81,-3.81; 5 -1.27,-3.81; 6 1.27,-3.81; 7 3.81,-3.81; 8 6.35,-3.81; 9 8.89,-3.81; 10 11.43,-3.81; 11 11.43,3.81; 12 8.89,3.81; 13 6.35,3.81; 14 3.81,3.81; 15 1.27,3.81; 16 -1.27,3.81; 17 -3.81,3.81; 18 -6.35,3.81; 19 -8.89,3.81; 20 -11.43,3.81
JP2 = drill 0.914 long: 1 -2.54,0; 2 0,0; 3 2.54,0
1X02 = drill 1.016 long: 1 -1.27,0; 2 1.27,0
ML10 = drill 0.914 octagon: 1 -5.08,-1.27; 2 -5.08,1.27; 3 -2.54,-1.27; 4 -2.54,1.27; 5 0,-1.27; 6 0,1.27; 7 2.54,-1.27; 8 2.54,1.27; 9 5.08,-1.27; 10 5.08,1.27
JP5Q = drill 0.914 octagon: 1 -5.08,-1.27; 2 -5.08,1.27; 3 -2.54,-1.27; 4 -2.54,1.27; 5 0,-1.27; 6 0,1.27; 7 2.54,-1.27; 8 2.54,1.27; 9 5.08,-1.27; 10 5.08,1.27
LED_PCB2 = drill 0.813 long: A 0,1.27; K 0,-1.27
9070-1W = drill 0.813 long: 1 5.08,-2.54; 2 5.08,0; 3 5.08,2.54 | drill 1.118 pad 1.778 round: B 0,-2.54; B1 0,2.54
W237-102 = drill 1.194 long: 1 -2.5,-1.27; 2 2.5,-1.27
0204/7 = drill 0.813 octagon: 1 -3.81,0; 2 3.81,0
B3F-31XX = drill 1.016 octagon: 1 -2.261,-1.245; 2 2.261,-1.245 | drill 1.499 pad 2.159 round: 3 -3.505,1.245; 4 3.505,1.245
SIL6 = drill 0.813 long: 1 -6.35,0; 2 -3.81,0; 3 -1.27,0; 4 1.27,0; 5 3.81,0; 6 6.35,0
SIL4 = drill 0.813 long: 1 -3.81,0; 2 -1.27,0; 3 1.27,0; 4 3.81,0
DIL14S@1 = drill 0.813 round: 1 -7.62,-3.81; 7 7.62,-3.81; 8 7.62,3.81; 14 -7.62,3.81

### Placement (x,y rotation side)
C1  41.27,64.77 180 top
C2  51.44,87 270 top
C3  24.77,79.38 270 top
C4  54.61,31.75 0 top
C5  110.49,29.21 0 top
C6  55.24,60.96 0 top
C7  96.52,29.21 0 top
C8  40.64,29.21 0 top
C9  82.55,29.21 0 top
C10  68.58,29.21 0 top
C11  40.64,93.34 0 top
C12  63.5,97.16 0 top
C13  77.47,97.16 0 top
CTRL  0,49.53 0 top
IC1  52.07,20.32 270 top
IC2  107.95,17.78 270 top
IC3  52.7,49.53 270 top
IC4  93.98,19.05 270 top
IC5  38.1,19.05 270 top
IC6  80.01,19.05 270 top
IC7  66.04,19.05 270 top
IC8  38.1,81.92 270 top
IC9  60.96,87 270 top
IC10  74.93,85.72 270 top
IC11  127.64,72.39 270 top
IC12  127.64,31.75 270 top
J1  91.44,87 180 top
J2  91.44,83.19 180 top
J3  91.44,79.38 180 top
J4  91.44,75.56 180 top
JP1  11.43,90.17 90 top
JP2  11.43,85.09 90 top
JP3  6.35,31.11 270 top
JP4  79.38,48.26 270 top
LED1  5.08,87.63 0 top
LED2  5.08,82.55 0 top
POWER  8.89,62.23 0 top
PSU  6.99,13.97 270 top
R1  16.51,85.09 270 top
R2  18.41,85.09 270 top
R3  25.4,20.32 270 top
R4  29.21,20.32 270 top
R5  27.3,20.32 90 top
R6  64.14,49.53 90 top
R7  23.5,20.32 270 top
R8  20.32,85.09 270 top
R9  29.21,79.38 270 top
R10  46.99,84.45 90 top
RESET  3.81,74.93 270 top
RN1  143.51,54.61 270 top
RN2  143.51,29.21 90 top
RN3  143.51,69.85 270 top
RN4  138.43,54.61 270 top
U$1  47.62,71.75 0 top
U$2  146.05,83.82 0 bottom
U$3  24.13,5.08 0 top
XTAL1  16.000MHz  [DIL14S@1]  38.1,50.8 270 top

### Tracks (layer width: path | path; a pad name or v marks a point on that pad's centre or on a via)
+12V  (2 unrouted)
-CLI  (1 unrouted)
-CLK  (2 unrouted)
-CLL  (1 unrouted)
-CLOCK  (1 unrouted)
-CPL  (1 unrouted)
-GUARD  (9 unrouted)
-INCA  (1 unrouted)
-INCDR  (1 unrouted)
-INCPC  (1 unrouted)
-IO  (1 unrouted)
-MEM  (1 unrouted)
-PWRON  (3 unrouted)
-R  (1 unrouted)
-RA  (1 unrouted)
-RAGL  (1 unrouted)
-RDR  (1 unrouted)
-RESET  (8 unrouted)
-RESET-IN  (3 unrouted)
-RPC  (1 unrouted)
-RSTHOLD  (5 unrouted)
-STI  (1 unrouted)
-STOP  (2 unrouted)
-W  (1 unrouted)
CLK  (2 unrouted)
CLK1  (1 unrouted)
CLK2  (2 unrouted)
CLK3  (3 unrouted)
CLK4  (2 unrouted)
CLK5  (1 unrouted)
CLKEN  (2 unrouted)
CLOCK  (1 unrouted)
GND
  pour Bottom (isolate 0.61, no thermals, hatched): 153.67,100.33 153.67,0 160.02,0 160.02,100.33
  pour Bottom (isolate 0.61, rank 2, no thermals): 0,100.33 160.02,100.33 160.02,0 0,0
IBUS0  (1 unrouted)
IBUS1  (1 unrouted)
IBUS2  (1 unrouted)
IBUS3  (1 unrouted)
IBUS4  (1 unrouted)
IBUS5  (1 unrouted)
IBUS6  (1 unrouted)
IBUS7  (1 unrouted)
IBUS8  (1 unrouted)
IBUS9  (1 unrouted)
IBUS10  (1 unrouted)
IBUS11  (1 unrouted)
IBUS12  (1 unrouted)
IBUS13  (1 unrouted)
IBUS14  (1 unrouted)
IBUS15  (1 unrouted)
N$2  (1 unrouted)
N$5  (2 unrouted)
N$6  (2 unrouted)
N$8  (1 unrouted)
N$9  (2 unrouted)
N$10  (1 unrouted)
N$11  (3 unrouted)
N$12  (2 unrouted)
N$13  (3 unrouted)
N$14  (2 unrouted)
N$15  (3 unrouted)
N$16  (2 unrouted)
N$17  (2 unrouted)
N$18  (2 unrouted)
N$19  (3 unrouted)
N$20  (2 unrouted)
N$21  (2 unrouted)
N$22  (2 unrouted)
N$23  (2 unrouted)
N$24  (1 unrouted)
N$25  (1 unrouted)
N$26  (1 unrouted)
N$27  (1 unrouted)
N$49  (2 unrouted)
POWERLED  (2 unrouted)
PWR_OK  (1 unrouted)
RESERVED_POWER  (2 unrouted)
RESET  (2 unrouted)
RUN  (2 unrouted)
RUNIT0  (2 unrouted)
RUNIT1  (2 unrouted)
RUNIT2  (2 unrouted)
RUNIT3  (2 unrouted)
STEP  (2 unrouted)
UINSTR18  (1 unrouted)
VCC
  pour Top (isolate 0.61, rank 2, no thermals): 153.67,100.33 153.67,0 160.02,0 160.02,100.33
  pour Top (isolate 0.61, rank 2, no thermals): 0,100.33 160.02,100.33 160.02,0 0,0

### Text on the board
Top: (c) 2011 AlexiosC
Bottom: (c) 2011 AlexiosC
tNames: + | AGL | + | PC | DR | AC | LED1: POWER | LED2: RUN | GUARD Pulse | Reset Input | Disabled | Enabled | Run/Step/Stop Ctl | GUARD delay | +5 | +4 | +3 | +2 | Read Unit Decoder | & GUARD assignment | +1 | ONE jumper | POWER ON | GUARD pulse generation | RESET | STOP | STEP | RUN | PS_ON | 1:2 Clock Divider | PWR_OK | (c) 2011 AlexiosC | Clock Enable | & 1:2 Divider | CFT CPU Power/Clock/Reset/Bus Term Rev D | http://www.bedroomlan.org/cft
tValues: +12V